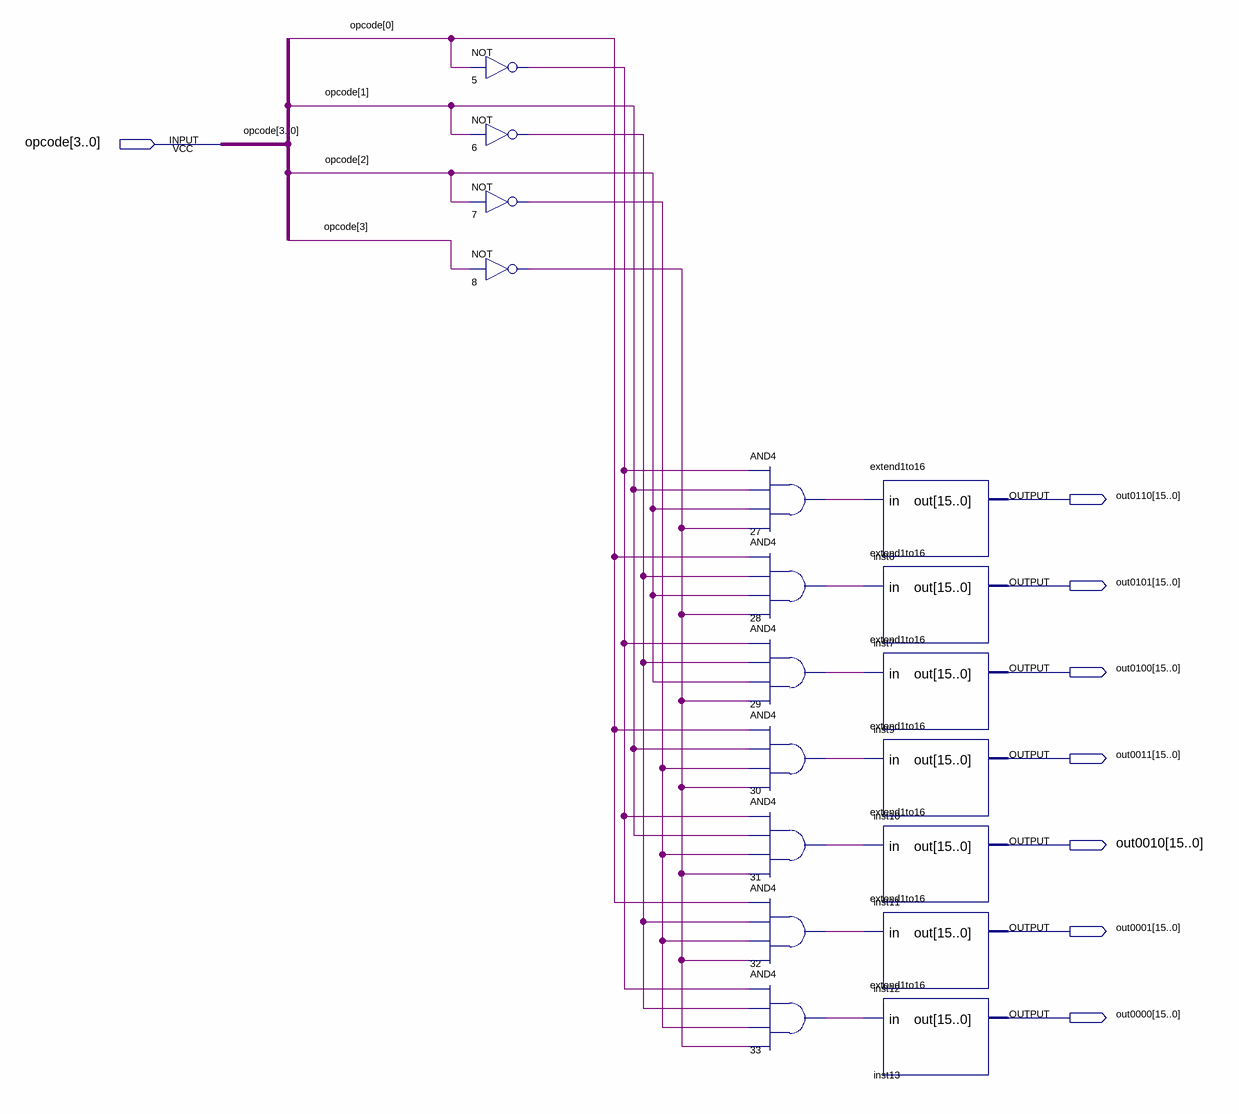
[diagram p0: schematic sheet]
// Quartus schematic ex1ALU_multiplexer.bdf as structural Verilog: 18 symbols, 8 pins
module ex1ALU_multiplexer (
  input  [3:0] opcode,
  output [15:0] out0110,
  output [15:0] out0101,
  output [15:0] out0100,
  output [15:0] out0011,
  output [15:0] out0010,
  output [15:0] out0001,
  output [15:0] out0000
);

  wire n5_out, n6_out, n7_out, n8_out, n27_out, n28_out, n29_out, n30_out, n31_out, n32_out, n33_out;

  not u_5 (n5_out, opcode[0]);
  not u_6 (n6_out, opcode[1]);
  not u_7 (n7_out, opcode[2]);
  not u_8 (n8_out, opcode[3]);
  and u_27 (n27_out, n5_out, opcode[1], opcode[2], n8_out);
  and u_28 (n28_out, opcode[0], n6_out, opcode[2], n8_out);
  and u_29 (n29_out, n5_out, n6_out, opcode[2], n8_out);
  and u_30 (n30_out, opcode[0], opcode[1], n7_out, n8_out);
  and u_31 (n31_out, n5_out, opcode[1], n7_out, n8_out);
  and u_32 (n32_out, opcode[0], n6_out, n7_out, n8_out);
  and u_33 (n33_out, n5_out, n6_out, n7_out, n8_out);
  extend1to16 inst6 (.in(n27_out), .out(out0110));
  extend1to16 inst7 (.in(n28_out), .out(out0101));
  extend1to16 inst9 (.in(n29_out), .out(out0100));
  extend1to16 inst10 (.in(n30_out), .out(out0011));
  extend1to16 inst11 (.in(n31_out), .out(out0010));
  extend1to16 inst12 (.in(n32_out), .out(out0001));
  extend1to16 inst13 (.in(n33_out), .out(out0000));
endmodule
